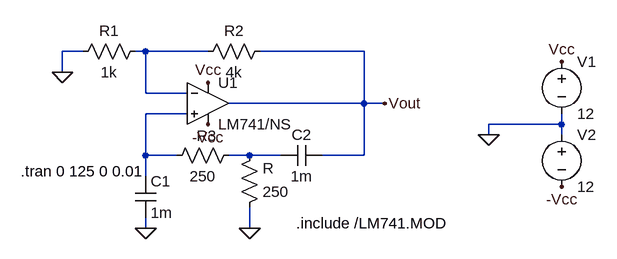
[diagram p0: schematic gvv.asc]
gvv.asc, the LTspice schematic file:
Version 4
SHEET 1 892 680
WIRE 16 64 -16 64
WIRE 112 64 96 64
WIRE 208 64 112 64
WIRE 448 64 288 64
WIRE -16 96 -16 64
WIRE 112 128 112 64
WIRE 176 128 112 128
WIRE 448 144 448 64
WIRE 448 144 240 144
WIRE 480 144 448 144
WIRE 176 160 112 160
WIRE 752 176 752 160
WIRE 752 176 640 176
WIRE 640 192 640 176
WIRE 752 192 752 176
WIRE 112 224 112 160
WIRE 160 224 112 224
WIRE 272 224 240 224
WIRE 320 224 272 224
WIRE 448 224 448 144
WIRE 448 224 384 224
WIRE 112 256 112 224
WIRE 112 336 112 320
WIRE 272 336 272 304
FLAG -16 96 0
FLAG 112 336 0
FLAG 272 336 0
FLAG 480 144 Vout
FLAG 640 192 0
FLAG 752 80 Vcc
FLAG 208 112 Vcc
FLAG 752 272 -Vcc
FLAG 208 176 -Vcc
SYMBOL res 112 48 R90
WINDOW 0 0 56 VBottom 2
WINDOW 3 32 56 VTop 2
SYMATTR InstName R1
SYMATTR Value 1k
SYMBOL res 304 48 R90
WINDOW 0 0 56 VBottom 2
WINDOW 3 32 56 VTop 2
SYMATTR InstName R2
SYMATTR Value 4k
SYMBOL res 256 208 R90
WINDOW 0 -14 65 VLeft 2
WINDOW 3 32 56 VTop 2
SYMATTR InstName R3
SYMATTR Value 250
SYMBOL res 256 320 M180
WINDOW 0 36 76 Left 2
WINDOW 3 36 40 Left 2
SYMATTR InstName R
SYMATTR Value 250
SYMBOL cap 96 256 R0
SYMATTR InstName C1
SYMATTR Value 1m
SYMBOL cap 384 208 R90
WINDOW 0 0 32 VBottom 2
WINDOW 3 32 32 VTop 2
SYMATTR InstName C2
SYMATTR Value 1m
SYMBOL Opamps\\opamp2 208 80 R0
SYMATTR InstName U1
SYMATTR Value LM741/NS
SYMBOL voltage 752 64 R0
WINDOW 123 0 0 Left 2
WINDOW 39 0 0 Left 2
SYMATTR InstName V1
SYMATTR Value 12
SYMBOL voltage 752 176 R0
WINDOW 123 0 0 Left 2
WINDOW 39 0 0 Left 2
SYMATTR InstName V2
SYMATTR Value 12
TEXT -80 248 Left 2 !.tran 0 125 0 0.01
TEXT 344 328 Left 2 !.include /LM741.MOD

The netlist it stands for:
* gvv.asc
R1 N001 0 1k
R2 Vout N001 4k
R3 N003 N002 250
R 0 N003 250
C1 N002 0 1m
C2 Vout N003 1m
XU1 N002 N001 Vcc -Vcc Vout LM741/NS  ; pins In+ In- V+ V- OUT
V1 Vcc 0 12
V2 0 -Vcc 12
.tran 0 125 0 0.01
.include /LM741.MOD
.backanno
.end